# Altium project LPC1787-LCD-PCB.PrjPcb (part 2 of 3)

## Sheet SOC LPC1787.SchDoc
size 914 x 685 mm
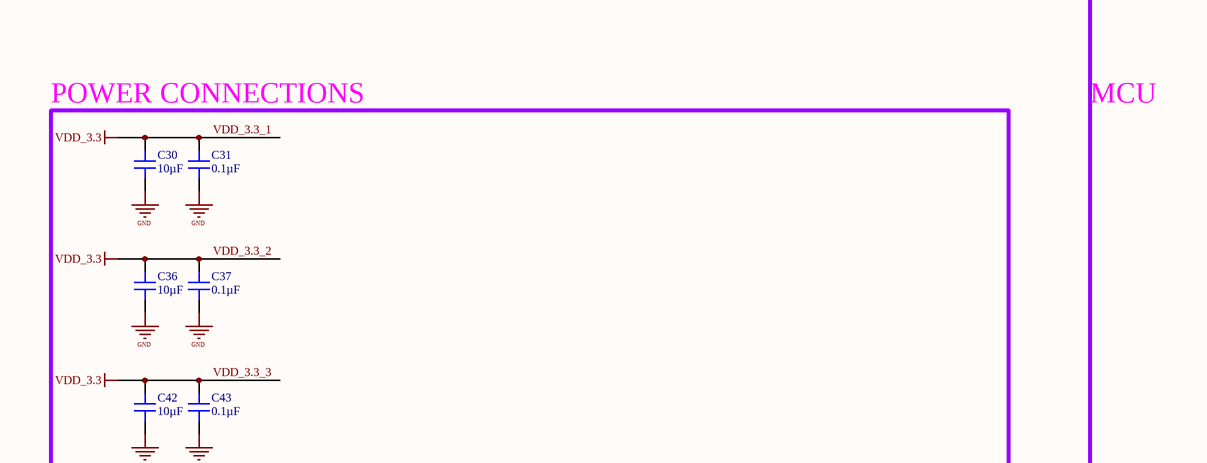
[diagram p3: SOC LPC1787.SchDoc, top left]
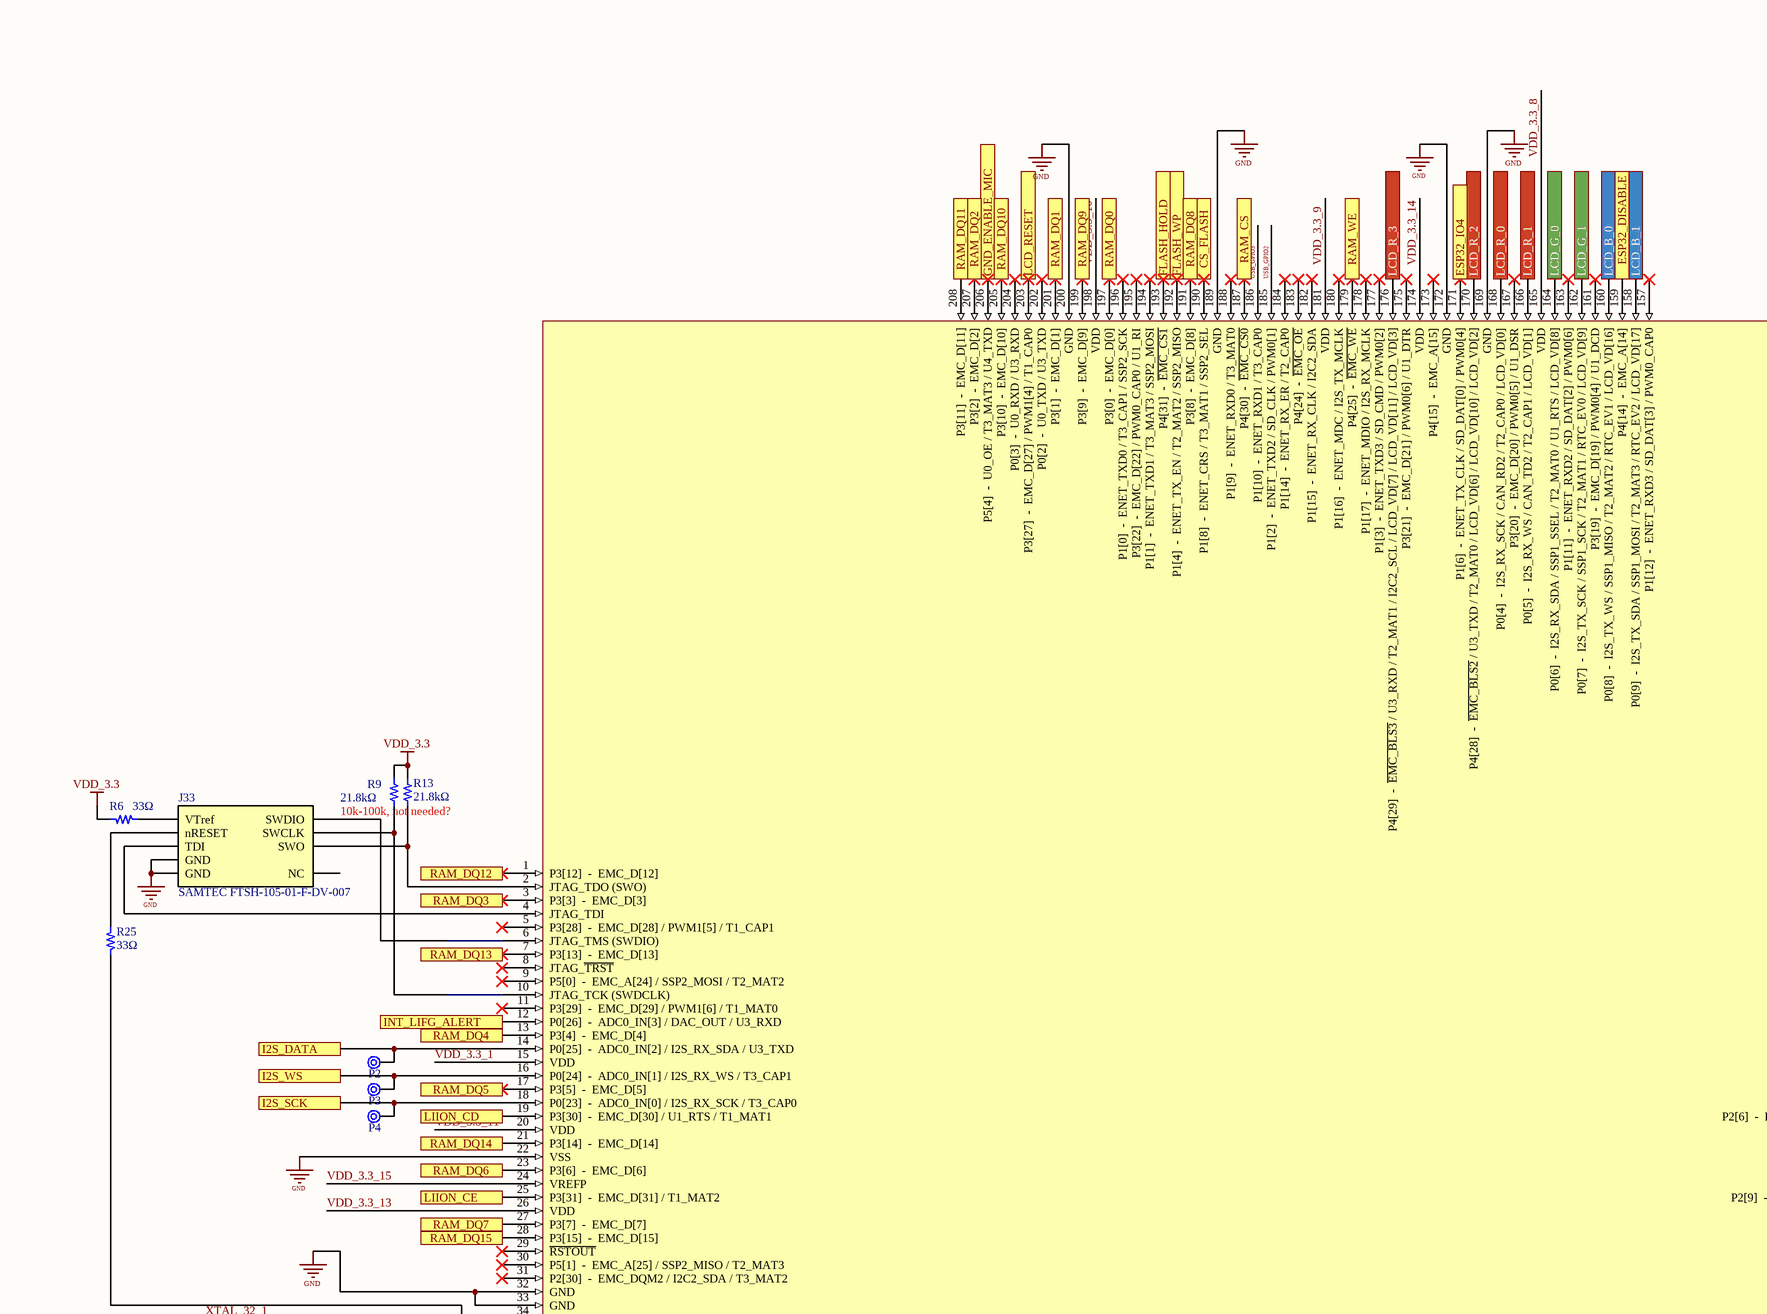
[diagram p4: SOC LPC1787.SchDoc, top middle]
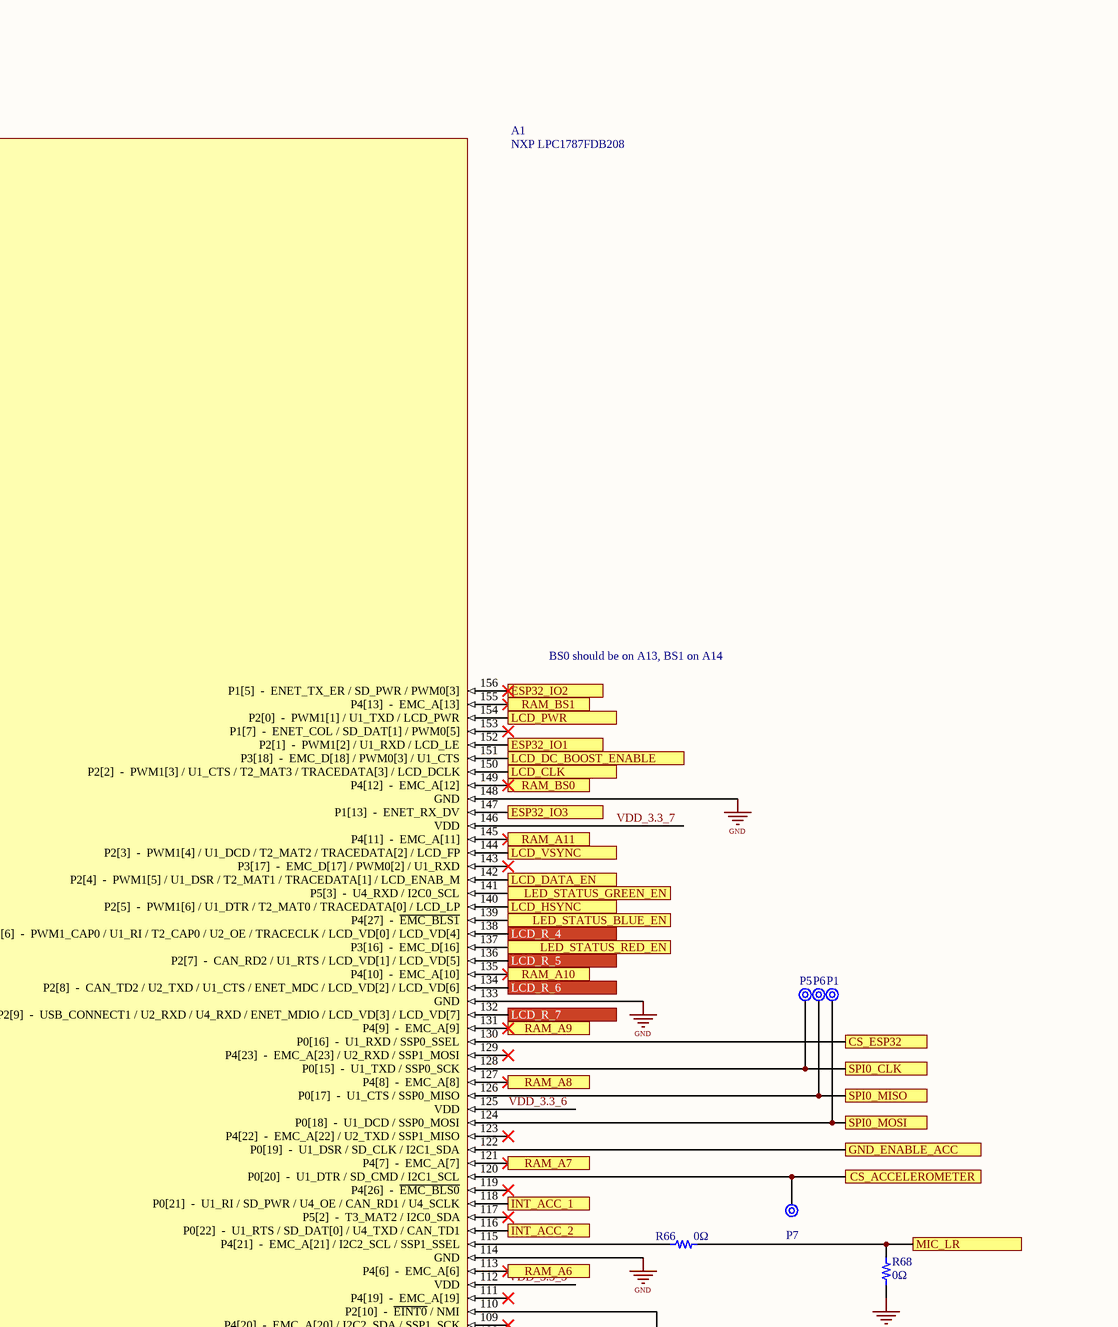
[diagram p5: SOC LPC1787.SchDoc, top right]
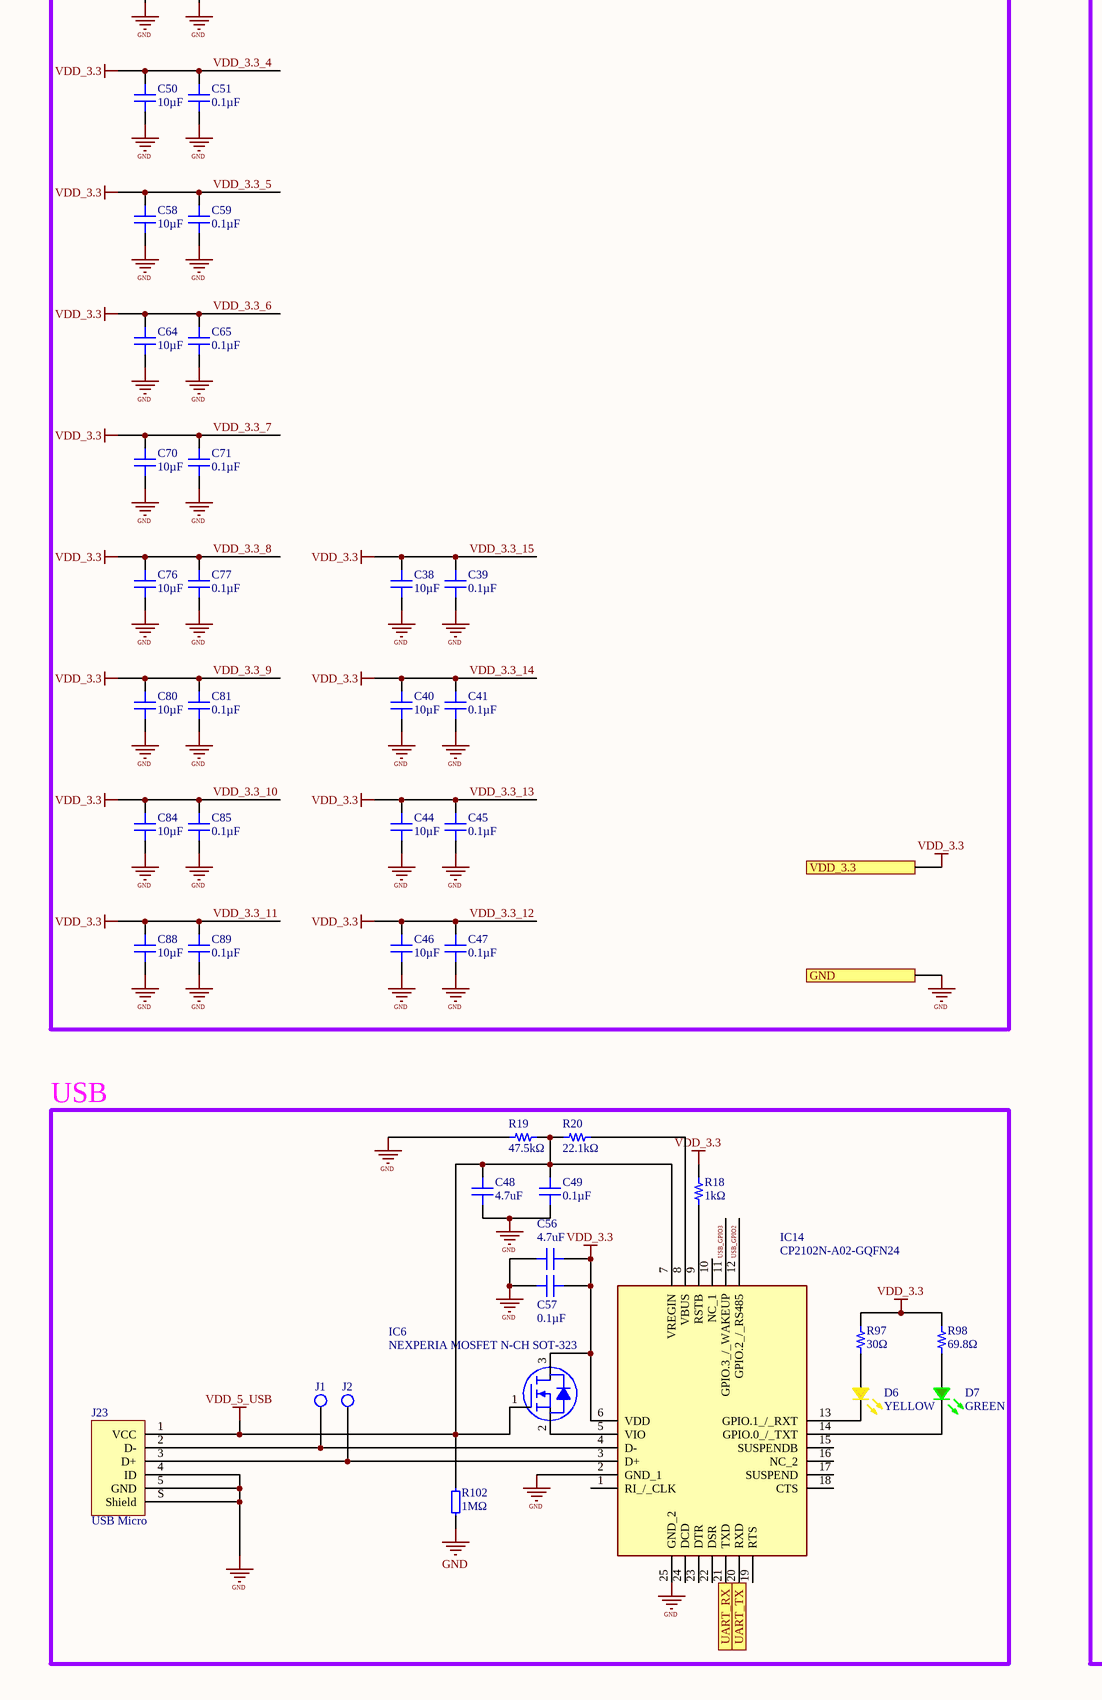
[diagram p6: SOC LPC1787.SchDoc, bottom left]
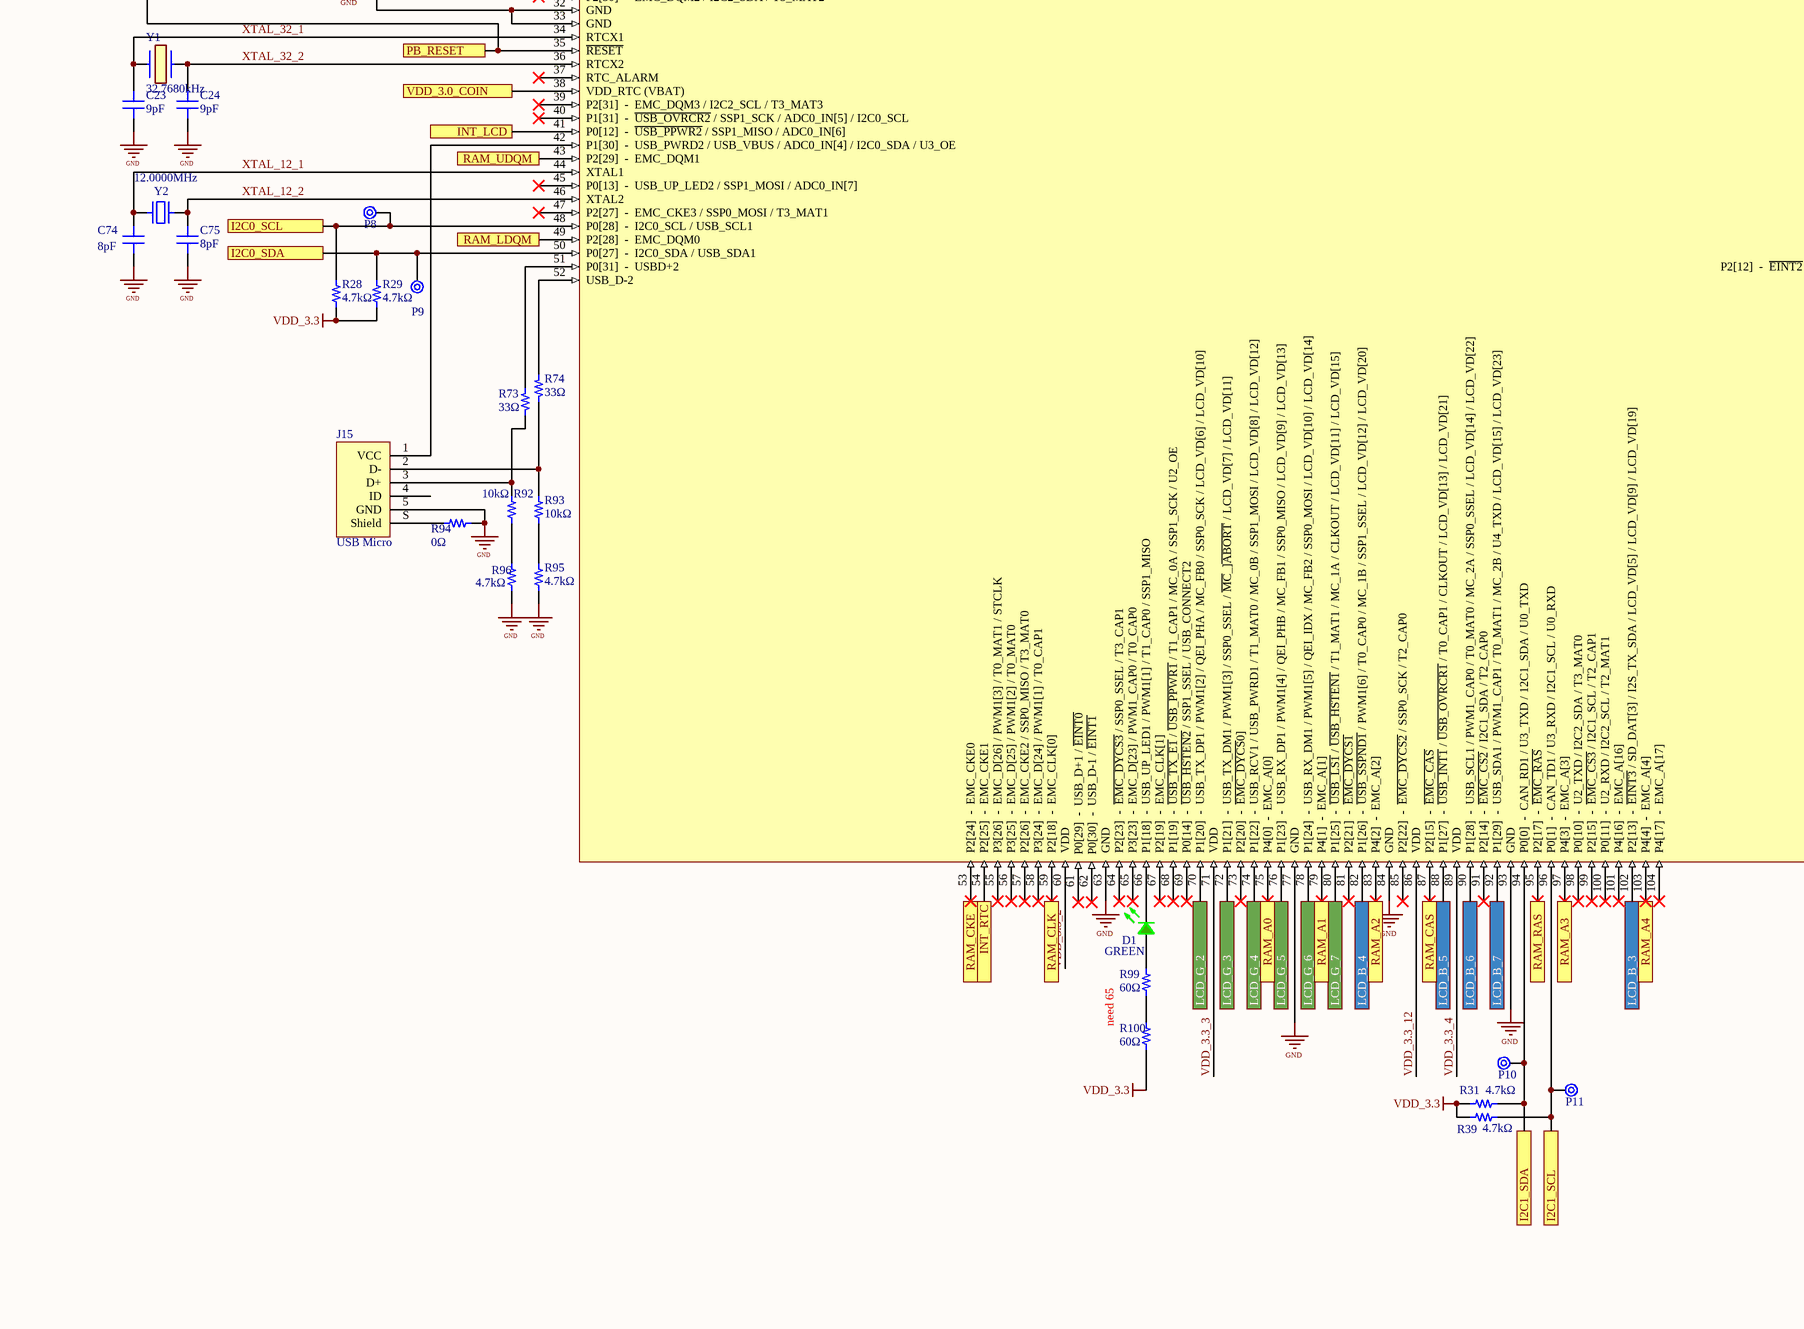
[diagram p7: SOC LPC1787.SchDoc, bottom middle]
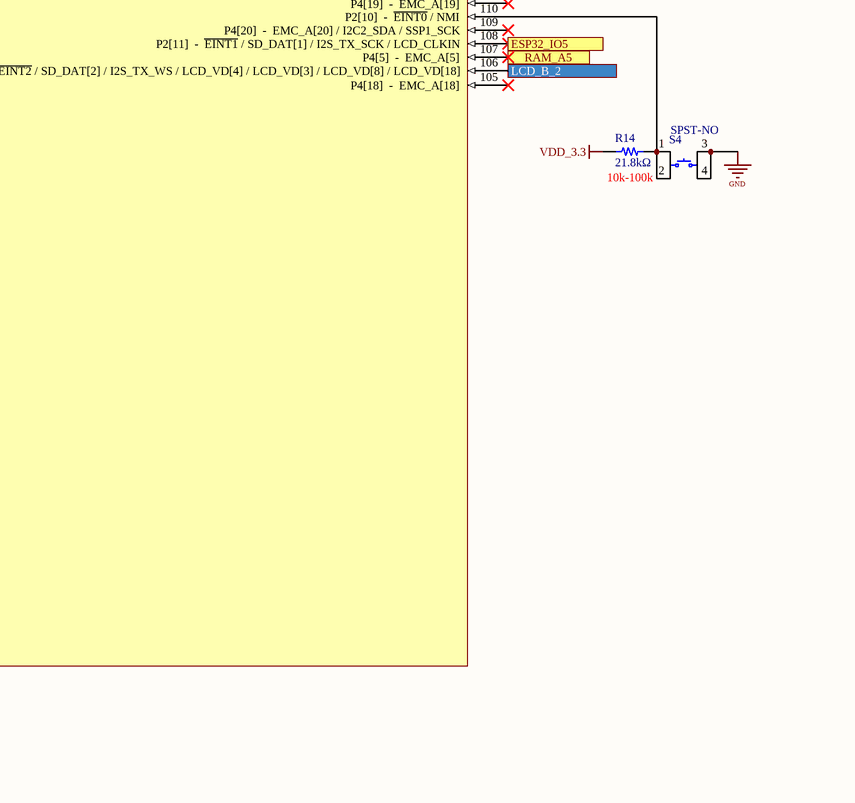
[diagram p8: SOC LPC1787.SchDoc, bottom right]

### Parts
A1  NXP LPC1787FDB208  [NXP LPC1787FDB208]
C23  9pF  [CAP 0402_1005]
C24  9pF  [CAP 0402_1005]
C30  10µF  [CAP 0603_1608]
C31  0.1µF  [CAP 0603_1608 RF]
C36  10µF  [CAP 0603_1608]
C37  0.1µF  [CAP 0603_1608 RF]
C38  10µF  [CAP 0603_1608]
C39  0.1µF  [CAP 0603_1608 RF]
C40  10µF  [CAP 0603_1608]
C41  0.1µF  [CAP 0603_1608 RF]
C42  10µF  [CAP 0603_1608]
C43  0.1µF  [CAP 0603_1608 RF]
C44  10µF  [CAP 0603_1608]
C45  0.1µF  [CAP 0603_1608 RF]
C46  10µF  [CAP 0603_1608]
C47  0.1µF  [CAP 0603_1608 RF]
C48  4.7uF  [CAP 0603_1608]
C49  0.1µF  [CAP 0603_1608 RF]
C50  10µF  [CAP 0603_1608]
C51  0.1µF  [CAP 0603_1608 RF]
C56  4.7uF  [CAP 0603_1608]
C57  0.1µF  [CAP 0603_1608 RF]
C58  10µF  [CAP 0603_1608]
C59  0.1µF  [CAP 0603_1608 RF]
C64  10µF  [CAP 0603_1608]
C65  0.1µF  [CAP 0603_1608 RF]
C70  10µF  [CAP 0603_1608]
C71  0.1µF  [CAP 0603_1608 RF]
C74  8pF  [CAP 0402_1005]
C75  8pF  [CAP 0402_1005]
C76  10µF  [CAP 0603_1608]
C77  0.1µF  [CAP 0603_1608 RF]
C80  10µF  [CAP 0603_1608]
C81  0.1µF  [CAP 0603_1608 RF]
C84  10µF  [CAP 0603_1608]
C85  0.1µF  [CAP 0603_1608 RF]
C88  10µF  [CAP 0603_1608]
C89  0.1µF  [CAP 0603_1608 RF]
D1  GREEN  [LED 0603_1608]
D6  YELLOW  [LED 0603_1608]
D7  GREEN  [LED 0603_1608]
IC6  NEXPERIA MOSFET N-CH SOT-323  [NEXPERIA SOT-323]
IC14  CP2102N-A02-GQFN24  [QFN50P400X400X80-25N-D]
J1  TEST POINT  [TEST POINT]  (value not drawn)
J2  TEST POINT  [TEST POINT]  (value not drawn)
J15  USB Micro  [MICRO USB B]
J23  USB Micro  [MICRO USB B]
J33  SAMTEC FTSH-105-01-F-DV-007  [SAMTEC_FTSH-105-01-F-DV-007]
P1  1 Pin  [1PINTHRU]  (value not drawn)
P2  1 Pin  [1PINTHRU]  (value not drawn)
P3  1 Pin  [1PINTHRU]  (value not drawn)
P4  1 Pin  [1PINTHRU]  (value not drawn)
P5  1 Pin  [1PINTHRU]  (value not drawn)
P6  1 Pin  [1PINTHRU]  (value not drawn)
P7  1 Pin  [1PINTHRU]  (value not drawn)
P8  1 Pin  [1PINTHRU]  (value not drawn)
P9  1 Pin  [1PINTHRU]  (value not drawn)
P10  1 Pin  [1PINTHRU]  (value not drawn)
P11  1 Pin  [1PINTHRU]  (value not drawn)
R6  33Ω  [RES 0201_0603]
R9  21.8kΩ  [RES 0603_1608 RF]
R13  21.8kΩ  [RES 0603_1608 RF]
R14  21.8kΩ  [RES 0603_1608 RF]
R18  1kΩ  [RES 0603_1608 RF]
R19  47.5kΩ  [RES 0603_1608 RF]
R20  22.1kΩ  [RES 0603_1608 RF]
R25  33Ω  [RES 0201_0603]
R28  4.7kΩ  [RES 0603_1608 RF]
R29  4.7kΩ  [RES 0603_1608 RF]
R31  4.7kΩ  [RES 0603_1608 RF]
R39  4.7kΩ  [RES 0603_1608 RF]
R66  0Ω  [RES 0603_1608 RF]
R68  0Ω  [RES 0603_1608 RF]
R73  33Ω  [RES 0201_0603]
R74  33Ω  [RES 0201_0603]
R92  10kΩ  [RES 0603_1608 RF]
R93  10kΩ  [RES 0603_1608 RF]
R94  0Ω  [RES 0603_1608 RF]
R95  4.7kΩ  [RES 0603_1608 RF]
R96  4.7kΩ  [RES 0603_1608 RF]
R97  30Ω  [RES 0603_1608 RF]
R98  69.8Ω  [RES 0603_1608 RF]
R99  60Ω  [RES 0603_1608 RF]
R100  60Ω  [RES 0603_1608 RF]
R102  1MΩ  [0603_1608 RF]  (no BOM)
S4  SPST-NO  [TE FSM4JSMA]
Y1  32.7680kHz  [EPSON FC135R]
Y2  12.0000MHz  [ECX 53B]

### Blocks framed on the sheet
MCU: A1 C23 C24 C74 C75 D1 J15 J33 P1-P11 R6 R9 R13 R14 R25 R28 R29 R31 R39 R66 R68 R73 R74 R92-R96 R99 R100 S4 Y1 Y2
POWER CONNECTIONS: C30 C31 C36-C47 C50 C51 C58 C59 C64 C65 C70 C71 C76 C77 C80 C81 C84 C85 C88 C89
USB: C48 C49 C56 C57 D6 D7 IC6 IC14 J1 J2 J23 R18-R20 R97 R98 R102

### Ports
CS_ACCELEROMETER, CS_ESP32, CS_FLASH, ESP32_DISABLE, ESP32_IO1, ESP32_IO2, ESP32_IO3, ESP32_IO4, ESP32_IO5, FLASH_HOLD, FLASH_WP, GND, GND_ENABLE_ACC, GND_ENABLE_MIC, I2C0_SCL, I2C0_SDA, I2C1_SCL, I2C1_SDA, I2S_DATA, I2S_SCK, I2S_WS, INT_ACC_1, INT_ACC_2, INT_LCD, INT_LIFG_ALERT, INT_RTC, LCD_B_0, LCD_B_1, LCD_B_2, LCD_B_3, LCD_B_4, LCD_B_5, LCD_B_6, LCD_B_7, LCD_CLK, LCD_DATA_EN, LCD_DC_BOOST_ENABLE, LCD_G_0, LCD_G_1, LCD_G_2, LCD_G_3, LCD_G_4, LCD_G_5, LCD_G_6, LCD_G_7, LCD_HSYNC, LCD_PWR, LCD_R_0, LCD_R_1, LCD_R_2, LCD_R_3, LCD_R_4, LCD_R_5, LCD_R_6, LCD_R_7, LCD_RESET, LCD_VSYNC, LED_STATUS_BLUE_EN, LED_STATUS_GREEN_EN, LED_STATUS_RED_EN, LIION_CD, LIION_CE, MIC_LR, PB_RESET, RAM_A0, RAM_A1, RAM_A2, RAM_A3, RAM_A4, RAM_A5, RAM_A6, RAM_A7, RAM_A8, RAM_A9, RAM_A10, RAM_A11, RAM_BS0, RAM_BS1, RAM_CAS, RAM_CKE, RAM_CLK, RAM_CS, RAM_DQ0, RAM_DQ1, RAM_DQ2, RAM_DQ3, RAM_DQ4, RAM_DQ5, RAM_DQ6, RAM_DQ7, RAM_DQ8, RAM_DQ9, RAM_DQ10, RAM_DQ11, RAM_DQ12, RAM_DQ13, RAM_DQ14, RAM_DQ15, RAM_LDQM, RAM_RAS, RAM_UDQM, RAM_WE, SPI0_CLK, SPI0_MISO, SPI0_MOSI, UART_RX, UART_TX, VDD_3.0_COIN, VDD_3.3

### Nets
GND: A1.22(VSS) A1.32(GND) A1.33(GND) A1.63(GND) A1.77(GND) A1.84(GND) A1.93(GND) A1.114(GND) A1.133(GND) A1.148(GND) A1.169(GND) A1.172(GND) A1.189(GND) A1.200(GND) C23.1 C24.1 C30.1 C31.1 C36.1 C37.1 C38.1 C39.1 C40.1 C41.1 C42.1 C43.1 C44.1 C45.1 C46.1 C47.1 C48.1 C49.1 C50.1 C51.1 C56.2 C57.1 C58.1 C59.1 C64.1 C65.1 C70.1 C71.1 C74.2 C75.2 C76.1 C77.1 C80.1 C81.1 C84.1 C85.1 C88.1 C89.1 IC14.2(GND_1) IC14.25(GND_2) J15.5(GND) J23.4(ID) J23.5(GND) J23.S(Shield) J33.03(GND) J33.05(GND) R19.2 R68.1 R94.2 R95.1 R96.1 R102.2 S4.3 S4.4 ; port GND
VDD_3.3_1: A1.15(VDD) A1.20(VDD) A1.24(VREFP) A1.26(VDD) A1.60(VDD) A1.71(VDD) A1.86(VDD) A1.89(VDD) A1.112(VDD) A1.125(VDD) A1.146(VDD) A1.165(VDD) A1.174(VDD) A1.181(VDD) A1.198(VDD) C30.2 C31.2 C36.2 C37.2 C38.2 C39.2 C40.2 C41.2 C42.2 C43.2 C44.2 C45.2 C46.2 C47.2 C50.2 C51.2 C56.1 C57.2 C58.2 C59.2 C64.2 C65.2 C70.2 C71.2 C76.2 C77.2 C80.2 C81.2 C84.2 C85.2 C88.2 C89.2 IC6.3(D) IC14.6(VDD) R6.2 R9.2 R13.2 R14.1 R18.2 R28.2 R29.2 R31.2 R39.2 R97.2 R98.2 R100.2 ; port VDD_3.3  [also labelled VDD_3.3, VDD_3.3_10, VDD_3.3_11, VDD_3.3_12, VDD_3.3_13, VDD_3.3_14, VDD_3.3_15, VDD_3.3_2, VDD_3.3_3, VDD_3.3_4, VDD_3.3_5, VDD_3.3_6, VDD_3.3_7, VDD_3.3_8, VDD_3.3_9]
VDD_5_USB: C48.2 C49.2 IC6.1(G) IC14.7(VREGIN) J23.1(VCC) R19.1 R20.1 R102.1
USB_GPIO2: A1.185(P1[2]__-__ENET_TXD2_/_SD_CLK_/_PWM0[1]) IC14.12(GPIO.2_/_RS485)
USB_GPIO3: A1.186(P1[10]__-__ENET_RXD1_/_T3_CAP0) IC14.11(GPIO.3_/_WAKEUP)
XTAL_12_1: A1.44(XTAL1) C74.1 Y2.2
XTAL_12_2: A1.46(XTAL2) C75.1 Y2.1
XTAL_32_1: A1.34(RTCX1) C23.2 Y1.1(CRYSTAL_1)
XTAL_32_2: A1.36(RTCX2) C24.2 Y1.2(CRYSTAL_2)
NetA1_1: A1.1(P3[12]__-__EMC_D[12]) ; port RAM_DQ12
NetA1_2: A1.2(JTAG_TDO_(SWO)) J33.06(SWO) R13.1
NetA1_3: A1.3(P3[3]__-__EMC_D[3]) ; port RAM_DQ3
NetA1_4: A1.4(JTAG_TDI) J33.08(TDI)
NetA1_6: A1.6(JTAG_TMS_(SWDIO)) J33.02(SWDIO)
NetA1_7: A1.7(P3[13]__-__EMC_D[13]) ; port RAM_DQ13
NetA1_10: A1.10(JTAG_TCK_(SWDCLK)) J33.04(SWCLK) R9.1
NetA1_12: A1.12(P0[26]__-__ADC0_IN[3]_/_DAC_OUT_/_U3_RXD) ; port INT_LIFG_ALERT
NetA1_13: A1.13(P3[4]__-__EMC_D[4]) ; port RAM_DQ4
NetA1_14: A1.14(P0[25]__-__ADC0_IN[2]_/_I2S_RX_SDA_/_U3_TXD) P2.1(PAD) ; port I2S_DATA
NetA1_16: A1.16(P0[24]__-__ADC0_IN[1]_/_I2S_RX_WS_/_T3_CAP1) P3.1(PAD) ; port I2S_WS
NetA1_17: A1.17(P3[5]__-__EMC_D[5]) ; port RAM_DQ5
NetA1_18: A1.18(P0[23]__-__ADC0_IN[0]_/_I2S_RX_SCK_/_T3_CAP0) P4.1(PAD) ; port I2S_SCK
NetA1_19: A1.19(P3[30]__-__EMC_D[30]_/_U1_RTS_/_T1_MAT1) ; port LIION_CD
NetA1_21: A1.21(P3[14]__-__EMC_D[14]) ; port RAM_DQ14
NetA1_23: A1.23(P3[6]__-__EMC_D[6]) ; port RAM_DQ6
NetA1_25: A1.25(P3[31]__-__EMC_D[31]_/_T1_MAT2) ; port LIION_CE
NetA1_27: A1.27(P3[7]__-__EMC_D[7]) ; port RAM_DQ7
NetA1_28: A1.28(P3[15]__-__EMC_D[15]) ; port RAM_DQ15
NetA1_35: A1.35(~{RESET}) R25.2 ; port PB_RESET
NetA1_38: A1.38(VDD_RTC_(VBAT)) ; port VDD_3.0_COIN
NetA1_41: A1.41(P0[12]__-__~{USB_PPWR2}_/_SSP1_MISO_/_ADC0_IN[6]) ; port INT_LCD
NetA1_42: A1.42(P1[30]__-__USB_PWRD2_/_USB_VBUS_/_ADC0_IN[4]_/_I2C0_SDA_/_U3_OE) J15.1(VCC)
NetA1_43: A1.43(P2[29]__-__EMC_DQM1) ; port RAM_UDQM
NetA1_48: A1.48(P0[28]__-__I2C0_SCL_/_USB_SCL1) P8.1(PAD) R28.1 ; port I2C0_SCL
NetA1_49: A1.49(P2[28]__-__EMC_DQM0) ; port RAM_LDQM
NetA1_50: A1.50(P0[27]__-__I2C0_SDA_/_USB_SDA1) P9.1(PAD) R29.1 ; port I2C0_SDA
NetA1_51: A1.51(P0[31]__-__USBD+2) R73.1
NetA1_52: A1.52(USB_D-2) R74.1
NetA1_53: A1.53(P2[24]__-__EMC_CKE0) ; port RAM_CKE
NetA1_54: A1.54(P2[25]__-__EMC_CKE1) ; port INT_RTC
NetA1_59: A1.59(P2[18]__-__EMC_CLK[0]) ; port RAM_CLK
NetA1_66: A1.66(P1[18]__-__USB_UP_LED1_/_PWM1[1]_/_T1_CAP0_/_SSP1_MISO) D1.2
NetA1_70: A1.70(P1[20]__-__USB_TX_DP1_/_PWM1[2]_/_QEI_PHA_/_MC_FB0_/_SSP0_SCK_/_LCD_VD[6]_/_LCD_VD[10]) ; port LCD_G_2
NetA1_72: A1.72(P1[21]__-__USB_TX_DM1_/_PWM1[3]_/_SSP0_SSEL_/_~{MC}_]~{ABORT}_/_LCD_VD[7]_/_LCD_VD[11]) ; port LCD_G_3
NetA1_74: A1.74(P1[22]__-__USB_RCV1_/_USB_PWRD1_/_T1_MAT0_/_MC_0B_/_SSP1_MOSI_/_LCD_VD[8]_/_LCD_VD[12]) ; port LCD_G_4
NetA1_75: A1.75(P4[0]__-__EMC_A[0]) ; port RAM_A0
NetA1_76: A1.76(P1[23]__-__USB_RX_DP1_/_PWM1[4]_/_QEI_PHB_/_MC_FB1_/_SSP0_MISO_/_LCD_VD[9]_/_LCD_VD[13]) ; port LCD_G_5
NetA1_78: A1.78(P1[24]__-__USB_RX_DM1_/_PWM1[5]_/_QEI_IDX_/_MC_FB2_/_SSP0_MOSI_/_LCD_VD[10]_/_LCD_VD[14]) ; port LCD_G_6
NetA1_79: A1.79(P4[1]__-__EMC_A[1]) ; port RAM_A1
NetA1_80: A1.80(P1[25]__-__~{USB_LS1}_/_~{USB_HSTEN1}_/_T1_MAT1_/_MC_1A_/_CLKOUT_/_LCD_VD[11]_/_LCD_VD[15]) ; port LCD_G_7
NetA1_82: A1.82(P1[26]__-__~{USB_SSPND1}_/_PWM1[6]_/_T0_CAP0_/_MC_1B_/_SSP1_SSEL_/_LCD_VD[12]_/_LCD_VD[20]) ; port LCD_B_4
NetA1_83: A1.83(P4[2]__-__EMC_A[2]) ; port RAM_A2
NetA1_87: A1.87(P2[15]__-__~{EMC_CAS}) ; port RAM_CAS
NetA1_88: A1.88(P1[27]__-__~{USB_INT1}_/_~{USB_OVRCR1}_/_T0_CAP1_/_CLKOUT_/_LCD_VD[13]_/_LCD_VD[21]) ; port LCD_B_5
NetA1_90: A1.90(P1[28]__-__USB_SCL1_/_PWM1_CAP0_/_T0_MAT0_/_MC_2A_/_SSP0_SSEL_/_LCD_VD[14]_/_LCD_VD[22]) ; port LCD_B_6
NetA1_92: A1.92(P1[29]__-__USB_SDA1_/_PWM1_CAP1_/_T0_MAT1_/_MC_2B_/_U4_TXD_/_LCD_VD[15]_/_LCD_VD[23]) ; port LCD_B_7
NetA1_94: A1.94(P0[0]__-__CAN_RD1_/_U3_TXD_/_12C1_SDA_/_U0_TXD) P10.1(PAD) R31.1 ; port I2C1_SDA
NetA1_95: A1.95(P2[17]__-__~{EMC_RAS}) ; port RAM_RAS
NetA1_96: A1.96(P0[1]__-__CAN_TD1_/_U3_RXD_/_I2C1_SCL_/_U0_RXD) P11.1(PAD) R39.1 ; port I2C1_SCL
NetA1_97: A1.97(P4[3]__-__EMC_A[3]) ; port RAM_A3
NetA1_102: A1.102(P2[13]__-__~{EINT3}_/_SD_DAT[3]_/_I2S_TX_SDA_/_LCD_VD[5]_/_LCD_VD[9]_/_LCD_VD[19]) ; port LCD_B_3
NetA1_103: A1.103(P4[4]__-__EMC_A[4]) ; port RAM_A4
NetA1_106: A1.106(P2[12]__-__~{EINT2}_/_SD_DAT[2]_/_I2S_TX_WS_/_LCD_VD[4]_/_LCD_VD[3]_/_LCD_VD[8]_/_LCD_VD[18]) ; port LCD_B_2
NetA1_107: A1.107(P4[5]__-__EMC_A[5]) ; port RAM_A5
NetA1_108: A1.108(P2[11]__-__~{EINT1}_/_SD_DAT[1]_/_I2S_TX_SCK_/_LCD_CLKIN) ; port ESP32_IO5
NetA1_110: A1.110(P2[10]__-__~{EINT0}_/_NMI) R14.2 S4.1 S4.2
NetA1_113: A1.113(P4[6]__-__EMC_A[6]) ; port RAM_A6
NetA1_115: A1.115(P4[21]__-__EMC_A[21]_/_I2C2_SCL_/_SSP1_SSEL) R66.1
NetA1_116: A1.116(P0[22]__-__U1_RTS_/_SD_DAT[0]_/_U4_TXD_/_CAN_TD1) ; port INT_ACC_2
NetA1_118: A1.118(P0[21]__-__U1_RI_/_SD_PWR_/_U4_OE_/_CAN_RD1_/_U4_SCLK) ; port INT_ACC_1
NetA1_120: A1.120(P0[20]__-__U1_DTR_/_SD_CMD_/_I2C1_SCL) P7.1(PAD) ; port CS_ACCELEROMETER
NetA1_121: A1.121(P4[7]__-__EMC_A[7]) ; port RAM_A7
NetA1_122: A1.122(P0[19]__-__U1_DSR_/_SD_CLK_/_I2C1_SDA) ; port GND_ENABLE_ACC
NetA1_124: A1.124(P0[18]__-__U1_DCD_/_SSP0_MOSI) P1.1(PAD) ; port SPI0_MOSI
NetA1_126: A1.126(P0[17]__-__U1_CTS_/_SSP0_MISO) P6.1(PAD) ; port SPI0_MISO
NetA1_127: A1.127(P4[8]__-__EMC_A[8]) ; port RAM_A8
NetA1_128: A1.128(P0[15]__-__U1_TXD_/_SSP0_SCK) P5.1(PAD) ; port SPI0_CLK
NetA1_130: A1.130(P0[16]__-__U1_RXD_/_SSP0_SSEL) ; port CS_ESP32
NetA1_131: A1.131(P4[9]__-__EMC_A[9]) ; port RAM_A9
NetA1_132: A1.132(P2[9]__-__USB_CONNECT1_/_U2_RXD_/_U4_RXD_/_ENET_MDIO_/_LCD_VD[3]_/_LCD_VD[7]) ; port LCD_R_7
NetA1_134: A1.134(P2[8]__-__CAN_TD2_/_U2_TXD_/_U1_CTS_/_ENET_MDC_/_LCD_VD[2]_/_LCD_VD[6]) ; port LCD_R_6
NetA1_135: A1.135(P4[10]__-__EMC_A[10]) ; port RAM_A10
NetA1_136: A1.136(P2[7]__-__CAN_RD2_/_U1_RTS_/_LCD_VD[1]_/_LCD_VD[5]) ; port LCD_R_5
NetA1_137: A1.137(P3[16]__-__EMC_D[16]) ; port LED_STATUS_RED_EN
NetA1_138: A1.138(P2[6]__-__PWM1_CAP0_/_U1_RI_/_T2_CAP0_/_U2_OE_/_TRACECLK_/_LCD_VD[0]_/_LCD_VD[4]) ; port LCD_R_4
NetA1_139: A1.139(P4[27]__-__~{EMC_BLS1}) ; port LED_STATUS_BLUE_EN
NetA1_140: A1.140(P2[5]__-__PWM1[6]_/_U1_DTR_/_T2_MAT0_/_TRACEDATA[0]_/_LCD_LP) ; port LCD_HSYNC
NetA1_141: A1.141(P5[3]__-__U4_RXD_/_I2C0_SCL) ; port LED_STATUS_GREEN_EN
NetA1_142: A1.142(P2[4]__-__PWM1[5]_/_U1_DSR_/_T2_MAT1_/_TRACEDATA[1]_/_LCD_ENAB_M) ; port LCD_DATA_EN
NetA1_144: A1.144(P2[3]__-__PWM1[4]_/_U1_DCD_/_T2_MAT2_/_TRACEDATA[2]_/_LCD_FP) ; port LCD_VSYNC
NetA1_145: A1.145(P4[11]__-__EMC_A[11]) ; port RAM_A11
NetA1_147: A1.147(P1[13]__-__ENET_RX_DV) ; port ESP32_IO3
NetA1_149: A1.149(P4[12]__-__EMC_A[12]) ; port RAM_BS0
NetA1_150: A1.150(P2[2]__-__PWM1[3]_/_U1_CTS_/_T2_MAT3_/_TRACEDATA[3]_/_LCD_DCLK) ; port LCD_CLK
NetA1_151: A1.151(P3[18]__-__EMC_D[18]_/_PWM0[3]_/_U1_CTS) ; port LCD_DC_BOOST_ENABLE
NetA1_152: A1.152(P2[1]__-__PWM1[2]_/_U1_RXD_/_LCD_LE) ; port ESP32_IO1
NetA1_154: A1.154(P2[0]__-__PWM1[1]_/_U1_TXD_/_LCD_PWR) ; port LCD_PWR
NetA1_155: A1.155(P4[13]__-__EMC_A[13]) ; port RAM_BS1
NetA1_156: A1.156(P1[5]__-__ENET_TX_ER_/_SD_PWR_/_PWM0[3]) ; port ESP32_IO2
NetA1_158: A1.158(P0[9]__-__I2S_TX_SDA_/_SSP1_MOSI_/_T2_MAT3_/_RTC_EV2_/_LCD_VD[17]) ; port LCD_B_1
NetA1_159: A1.159(P4[14]__-__EMC_A[14]) ; port ESP32_DISABLE
NetA1_160: A1.160(P0[8]__-__I2S_TX_WS_/_SSP1_MISO_/_T2_MAT2_/_RTC_EV1_/_LCD_VD[16]) ; port LCD_B_0
NetA1_162: A1.162(P0[7]__-__I2S_TX_SCK_/_SSP1_SCK_/_T2_MAT1_/_RTC_EV0_/_LCD_VD[9]) ; port LCD_G_1
NetA1_164: A1.164(P0[6]__-__I2S_RX_SDA_/_SSP1_SSEL_/_T2_MAT0_/_U1_RTS_/_LCD_VD[8]) ; port LCD_G_0
NetA1_166: A1.166(P0[5]__-__I2S_RX_WS_/_CAN_TD2_/_T2_CAP1_/_LCD_VD[1]) ; port LCD_R_1
NetA1_168: A1.168(P0[4]__-__I2S_RX_SCK_/_CAN_RD2_/_T2_CAP0_/_LCD_VD[0]) ; port LCD_R_0
NetA1_170: A1.170(P4[28]__-__~{EMC_BLS2}_/_U3_TXD_/_T2_MAT0_/_LCD_VD[6]_/_LCD_VD[10]_/_LCD_VD[2]) ; port LCD_R_2
NetA1_171: A1.171(P1[6]__-__ENET_TX_CLK_/_SD_DAT[0]_/_PWM0[4]) ; port ESP32_IO4
NetA1_176: A1.176(P4[29]__-__~{EMC_BLS3}_/_U3_RXD_/_T2_MAT1_/_I2C2_SCL_/_LCD_VD[7]_/_LCD_VD[11]_/_LCD_VD[3]) ; port LCD_R_3
NetA1_179: A1.179(P4[25]__-__~{EMC_WE}) ; port RAM_WE
NetA1_187: A1.187(P4[30]__-__~{EMC_CS0}) ; port RAM_CS
NetA1_190: A1.190(P1[8]__-__ENET_CRS_/_T3_MAT1_/_SSP2_SEL) ; port CS_FLASH
NetA1_191: A1.191(P3[8]__-__EMC_D[8]) ; port RAM_DQ8
NetA1_192: A1.192(P1[4]__-__ENET_TX_EN_/_T2_MAT2_/_SSP2_MISO) ; port FLASH_WP
NetA1_193: A1.193(P4[31]__-__~{EMC_CS1}) ; port FLASH_HOLD
NetA1_197: A1.197(P3[0]__-__EMC_D[0]) ; port RAM_DQ0
NetA1_199: A1.199(P3[9]__-__EMC_D[9]) ; port RAM_DQ9
NetA1_201: A1.201(P3[1]__-__EMC_D[1]) ; port RAM_DQ1
NetA1_203: A1.203(P3[27]__-__EMC_D[27]_/_PWM1[4]_/_T1_CAP0) ; port LCD_RESET
NetA1_205: A1.205(P3[10]__-__EMC_D[10]) ; port RAM_DQ10
NetA1_206: A1.206(P5[4]__-__U0_OE_/_T3_MAT3_/_U4_TXD) ; port GND_ENABLE_MIC
NetA1_207: A1.207(P3[2]__-__EMC_D[2]) ; port RAM_DQ2
NetA1_208: A1.208(P3[11]__-__EMC_D[11]) ; port RAM_DQ11
NetD1_1: D1.1 R99.2
NetD6_1: D6.1 R97.1
NetD6_2: D6.2 IC14.13(GPIO.1_/_RXT)
NetD7_1: D7.1 R98.1
NetD7_2: D7.2 IC14.14(GPIO.0_/_TXT)
NetIC6_2: IC6.2(S) IC14.5(VIO)
NetIC14_3: IC14.3(D+) J2.1(PAD) J23.3(D+)
NetIC14_4: IC14.4(D-) J1.1(PAD) J23.2(D-)
NetIC14_8: IC14.8(VBUS) R20.2
NetIC14_9: IC14.9(RSTB) R18.1
NetIC14_20: IC14.20(RXD) ; port UART_TX
NetIC14_21: IC14.21(TXD) ; port UART_RX
NetJ15_2: J15.2(D-) R74.2 R93.2
NetJ15_3: J15.3(D+) R73.2 R92.2
NetJ15_S: J15.S(Shield) R94.1
NetJ33_01: J33.01(VTref) R6.1
NetJ33_10: J33.10(nRESET) R25.1
NetMK1_1: R66.2 R68.2 ; port MIC_LR
NetR92_1: R92.1 R96.2
NetR93_1: R93.1 R95.2
NetR99_1: R99.1 R100.1

Not connected (* = marked no-connect by the designer): A1 5(P3[28]__-__EMC_D[28]_/_PWM1[5]_/_T1_CAP1)* 8(JTAG_~{TRST})* 9(P5[0]__-__EMC_A[24]_/_SSP2_MOSI_/_T2_MAT2)* 11(P3[29]__-__EMC_D[29]_/_PWM1[6]_/_T1_MAT0)* 29(~{RSTOUT})* 30(P5[1]__-__EMC_A[25]_/_SSP2_MISO_/_T2_MAT3)* 31(P2[30]__-__EMC_DQM2_/_I2C2_SDA_/_T3_MAT2)* 37(RTC_ALARM)* 39(P2[31]__-__EMC_DQM3_/_I2C2_SCL_/_T3_MAT3)* 40(P1[31]__-__~{USB_OVRCR2}_/_SSP1_SCK_/_ADC0_IN[5]_/_I2C0_SCL)* 45(P0[13]__-__USB_UP_LED2_/_SSP1_MOSI_/_ADC0_IN[7])* 47(P2[27]__-__EMC_CKE3_/_SSP0_MOSI_/_T3_MAT1)* 55(P3[26]__-__EMC_D[26]_/_PWM1[3]_/_T0_MAT1_/_STCLK)* 56(P3[25]__-__EMC_D[25]_/_PWM1[2]_/_T0_MAT0)* 57(P2[26]__-__EMC_CKE2_/_SSP0_MISO_/_T3_MAT0)* 58(P3[24]__-__EMC_D[24]_/_PWM1[1]_/_T0_CAP1)* 61(P0[29]__-__USB_D+1_/_~{EINT0})* 62(P0[30]__-__USB_D-1_/_~{EINT1})* 64(P2[23]__-__~{EMC_DYCS3}_/_SSP0_SSEL_/_T3_CAP1)* 65(P3[23]__-__EMC_D[23]_/_PWM1_CAP0_/_T0_CAP0)* 67(P2[19]__-__EMC_CLK[1])* 68(P1[19]__-__~{USB_TX_E1}_/_~{USB_PPWR1}_/_T1_CAP1_/_MC_0A_/_SSP1_SCK_/_U2_OE)* 69(P0[14]__-__~{USB_HSTEN2}_/_SSP1_SSEL_/_USB_CONNECT2)* 73(P2[20]__-__~{EMC_DYCS}0])* 81(P2[21]__-__~{EMC_DYCS1})* 85(P2[22]__-__~{EMC_DYCS2}_/_SSP0_SCK_/_T2_CAP0)* 91(P2[14]__-__~{EMC_CS2}_/_I2C1_SDA_/_T2_CAP0)* 98(P0[10]__-__U2_TXD_/_I2C2_SDA_/_T3_MAT0)* 99(P2[15]__-__~{EMC_CS3}_/_I2C1_SCL_/_T2_CAP1)* 100(P0[11]__-__U2_RXD_/_I2C2_SCL_/_T2_MAT1)* 101(P4[16]__-__EMC_A[16])* 104(P4[17]__-__EMC_A[17])* 105(P4[18]__-__EMC_A[18])* 109(P4[20]__-__EMC_A[20]_/_I2C2_SDA_/_SSP1_SCK)* 111(P4[19]__-__EMC_A[19])* 117(P5[2]__-__T3_MAT2_/_I2C0_SDA)* 119(P4[26]__-__~{EMC_BLS0})* 123(P4[22]__-__EMC_A[22]_/_U2_TXD_/_SSP1_MISO)* 129(P4[23]__-__EMC_A[23]_/_U2_RXD_/_SSP1_MOSI)* 143(P3[17]__-__EMC_D[17]_/_PWM0[2]_/_U1_RXD)* 153(P1[7]__-__ENET_COL_/_SD_DAT[1]_/_PWM0[5])* 157(P1[12]__-__ENET_RXD3_/_SD_DAT[3]_/_PWM0_CAP0)* 161(P3[19]__-__EMC_D[19]_/_PWM0[4]_/_U1_DCD)* 163(P1[11]__-__ENET_RXD2_/_SD_DAT[2]_/_PWM0[6])* 167(P3[20]__-__EMC_D[20]_/_PWM0[5]_/_U1_DSR)* 173(P4[15]__-__EMC_A[15])* 175(P3[21]__-__EMC_D[21]_/_PWM0[6]_/_U1_DTR)* 177(P1[3]__-__ENET_TXD3_/_SD_CMD_/_PWM0[2])* 178(P1[17]__-__ENET_MDIO_/_I2S_RX_MCLK)* 180(P1[16]__-__ENET_MDC_/_I2S_TX_MCLK)* 182(P1[15]__-__ENET_RX_CLK_/_I2C2_SDA)* 183(P4[24]__-__~{EMC_OE})* 184(P1[14]__-__ENET_RX_ER_/_T2_CAP0)* 188(P1[9]__-__ENET_RXD0_/_T3_MAT0)* 194(P1[1]__-__ENET_TXD1_/_T3_MAT3_/_SSP2_MOSI)* 195(P3[22]__-__EMC_D[22]_/_PWM0_CAP0_/_U1_RI)* 196(P1[0]__-__ENET_TXD0_/_T3_CAP1_/_SSP2_SCK)* 202(P0[2]__-__U0_TXD_/_U3_TXD)* 204(P0[3]__-__U0_RXD_/_U3_RXD)*; IC14 1(RI_/_CLK) 10(NC_1) 15(SUSPENDB) 16(NC_2) 17(SUSPEND) 18(CTS) 19(RTS) 22(DSR) 23(DTR) 24(DCD); J15 4(ID); J33 09(NC)

### Notes on the sheet
- 10k-100k, not needed?
- BS0 should be on A13, BS1 on A14
- 10k-100k
- need 65

### Library data of the parts
A1 = SOC00006: VALUE: SoC; Voltage Supply: 2.4V ~ 3.6V; GPIO: 145; Device ID: SOC00006; Part Type: IC; Manufacturer: NXP; Manufacturer P/N: LPC1787FDB208; Package: MODULE; Supplier1: Digi-Key; Supplier1 P/N: 568-7575-ND‎; Supplier2: Mouser; Supplier2 P/N: 771-LPC1787FBD208551; Mounting Type: Surface Mount
C23 C24 = CAP0004E: CAP CER 9PF 50V NPO 0402; Manufacturer: Walsin; Manufacturer P/N: 0402N9R0B500CT; Tolerance: ±0.1%; Temperature Coefficient: C0G, NP0; Device ID: CAP0004E; Mounting Type: Surface Mount; Part Type: Capacitor; VALUE: 9pF; Operating Temperature: -55°C ~ 125°C; Voltage: 50V; Package: 0402 (1005 Metric); Supplier1: Digi-Key; Supplier1 P/N: 1292-0402N9R0B500CTTR-ND; Supplier2: Mouser; Supplier2 P/N: 791-0402N9R0B500CT
C30 C36 C38 C40 C42 C44 C46 C50 C58 C64 C70 C76 C80 C84 C88 = CAP00040: CAP CER 010UF 25V X7R 0603; Manufacturer: KEMET; Manufacturer P/N: C0603C273K3RACTU; Tolerance: ±10%; Device ID: CAP00040; Mounting Type: Surface Mount; Part Type: Capacitor; VALUE: 10µF; Operating Temperature: -55°C ~ 125°C; Voltage: 25V; Package: 0603 (1608 Metric); Supplier1: Digi-Key; Supplier1 P/N: 399-7891-1-ND; Supplier2: Mouser; Supplier2 P/N: 80-C0603C273K3R; Temperature Coefficient: X7R
C31 C37 C39 C41 C43 C45 C47 C49 C51 C57 C59 C65 C71 C77 C81 C85 C89 = CAP00039: CAP CER 0.1UF 16V X7R 0603; Manufacturer: KEMET; Manufacturer P/N: C0603C104M4RACAUTO; Tolerance: ±20%; Device ID: CAP00039; Mounting Type: Surface Mount; Part Type: Capacitor; VALUE: 0.1µF; Operating Temperature: -55°C ~ 125°C; Voltage: 16V; Package: 0603 (1608 Metric); Supplier1: Digi-Key; Supplier1 P/N: 399-C0603C104M4RACAUTOCT-ND; Supplier2: Mouser; Supplier2 P/N: C0603C104M4RACAUTO; Temperature Coefficient: X7R
C48 C56 = CAP00044: CAP CER 4.7UF 50V X7R 0603; Manufacturer: KEMET; Manufacturer P/N: CL10A475KQ8NNNC; Voltage: 25V; Tolerance: ±10%; Device ID: CAP00044; Mounting Type: Surface Mount; Part Type: Capacitor; VALUE: 4.7uF; Operating Temperature: -55°C ~ 125°C; Package: 0603 (1608 Metric); Supplier1: Digi-Key; Supplier1 P/N: 399-7891-1-ND; Supplier2: Mouser; Supplier2 P/N: 80-C0603C273K3R; Temperature Coefficient: X7R
C74 C75 = CAP00042: CAP CER 12.5PF 16V C0G/NP0 0402; Manufacturer: KEMET; Manufacturer P/N: C0402C101K4GACTU; Voltage: 10V; Tolerance: ±1%; Temperature Coefficient: C0G, NP0; Device ID: CAP00042; Mounting Type: Surface Mount; Part Type: Capacitor; VALUE: 8pF; Operating Temperature: -55°C ~ 125°C; Package: 0402 (1005 Metric); Supplier1: Digi-Key; Supplier1 P/N: 399-7749-1-ND; Supplier2: Mouser; Supplier2 P/N: 80-C0402C101K4G
D1 D7 = LED0000B: LED RED CLEAR 0603 SMD; Manufacturer: Würth Elektronik; Manufacturer P/N: 150060RS75000; If - Forward Current: 100mA; Vf - Forward Voltage: 2.0V; Wavelength: 625nm; Viewing Angle: 140°; Lens Color: Colorless; Device ID: LED0000B; VALUE: GREEN; Mounting Type: Surface Mount; Part Type: LED; Operating Temperature: -40°C ~ 85°C; Package: 0603 (1608 Metric); Color: Red; Supplier1: Digi-Key; Supplier1 P/N: 732-4978-1-ND
D6 = LED0000D: LED RED CLEAR 0603 SMD; Manufacturer: Würth Elektronik; Manufacturer P/N: 150060RS75000; If - Forward Current: 100mA; Vf - Forward Voltage: 2.0V; Wavelength: 625nm; Viewing Angle: 140°; Lens Color: Colorless; Device ID: LED0000D; VALUE: YELLOW; Mounting Type: Surface Mount; Part Type: LED; Operating Temperature: -40°C ~ 85°C; Package: 0603 (1608 Metric); Color: Red; Supplier1: Digi-Key; Supplier1 P/N: 732-4978-1-ND
IC6 = MOS00000: MOSFET N-CH 60V 320MA SOT323; Manufacturer: Nexperia USA Inc.; Manufacturer P/N: BSS138PW,115; FET Type: N-Channel; VALUE: NFET; Current - Continuous Drain (Id) @ 25°C: 320mA (Ta); Drive Voltage (Max Rds On, Min Rds On): 10V; Rds On (Max) @ Id, Vgs: 1.6Ohm @ 300mA, 10V; Vgs(th) (Max) @ Id: 1.5V @ 250µA; Vgs (Max): ±20V; Power Dissipation (Max): 260mW (Ta), 830mW (Tc); Gate Charge (Qg) (Max) @ Vgs: 0.8 nC @ 4.5 V; Input Capacitance (Ciss) (Max) @ Vds: 50 pF @ 10 V; Device ID: MOS00000; Package: SOT-323; Part Type: IC; Technology: MOSFET (Metal Oxide); FET Feature: -; Operating Temperature: -55°C ~ 150°C (TA); Mounting Type: Surface Mount; Drain to Source Voltage (Vdss): 60V; Supplier1: Digi-Key; Supplier1 P/N: 1727-1143-1-ND; Supplier2: Mouser; Supplier2 P/N: 771-BSS138PW115
IC14 = CP2102N-A02-GQFN24: Integrated Circuit; Manufacturer_Name: Silicon Labs; Datasheet Link: https://componentsearchengine.com//CP2102N-A02-GQFN24.pdf; Height: 0.8mm; Mouser2 Part Number: 634-CP2102NA02GQFN24; Mouser2 Price/Stock: https://www.mouser.com/Search/Refine.aspx?Keyword=634-CP2102NA02GQFN24; Manufacturer_Part_Number: CP2102N-A02-GQFN24
J1 J2 = -: Device ID: CON00015; Connector Type: Pad; Number of Positions: 1; Number of Positions Loaded: All; VALUE: Test Point; Mounting Type: Surface Mount; Part Type: Header; Manufacturer: -; Manufacturer P/N: -; Operating Temperature: -; Package: -; Contact Type: Pad; Style: Pad; Pitch - Mating: -; Fastening Type: -; Contact Finish - Mating: Gold; Insulation Color: -; Material Flammability Rating: -; Current Rating (Amps): -; Voltage Rating: -; Supplier1: -; Supplier1 P/N: -; Supplier2: -; Supplier2 P/N: -
J15 J23 = USB MICRO B: Manufacturer: TE; Manufacturer P/N: 123; Device ID: CON00014; VALUE: 5-Pin Board-to-Cable; Connector Type: Center Strip Contacts; Style: Board to Board; Number of Positions: 9; Number of Positions Loaded: All; Pitch - Mating: 0.012" (0.30mm); Mounting Type: Surface Mount; Part Type: Header; Operating Temperature: -40°C ~ 105°C; Package: N/A; Contact Type: Pins; Fastening Type: -; Contact Finish - Mating: Tin; Insulation Color: -; Material Flammability Rating: -; Current Rating (Amps): -; Voltage Rating: -; Supplier1: Digi-Key; Supplier1 P/N: 1253-046844745002846+CT-ND; Supplier2: Mouser; Supplier2 P/N: 346-046844745002846+
J33 = 9 PIN JLINK: Connector Header Surface Mount 10 position 0.050 (1.27mm); Manufacturer: TE; Manufacturer P/N: 123; Value: 9-Pin Board-to-Board; MP: FTSH-105-01-F-DV-007-K-P; Device ID: CON00013; Connector Type: Center Strip Contacts; Style: Board to Board; Number of Positions: 9; Number of Positions Loaded: All; Pitch - Mating: 0.012" (0.30mm); SnapEDA_Link: https://www.snapeda.com/parts/FTSH-105-01-F-DV-007-K-P/Samtec%20Inc./view-part/700165/?ref=snap; MF: Samtec; Digi-Key_Part_Number: SAM13926TR-ND; Check_prices: https://www.snapeda.com/parts/FTSH-105-01-F-DV-007-K-P/Samtec%20Inc./view-part/700165/?ref=eda; Package: N/A; Purchase-URL: https://pricing.snapeda.com/search/part/FTSH-105-01-F-DV-007-K-P/?ref=eda; Mounting Type: Surface Mount; Part Type: Header; Operating Temperature: -40°C ~ 105°C; Contact Type: Pins; Fastening Type: -; Contact Finish - Mating: Tin; Insulation Color: -; Material Flammability Rating: -; Current Rating (Amps): -; Voltage Rating: -; Supplier1: Digi-Key; Supplier1 P/N: 1253-046844745002846+CT-ND; Supplier2: Mouser; Supplier2 P/N: 346-046844745002846+
P1-P11 = 1 THRU HOLE: Device ID: CON00017; VALUE: 1 Pin Thru; Connector Type: Center Strip Contacts; Style: Board to Board; Number of Positions: 1; Number of Positions Loaded: All; Mounting Type: Surface Mount; Part Type: Header; Package: N/A; Contact Type: Pins; Pitch - Mating: -; Fastening Type: -; Contact Finish - Mating: Tin; Insulation Color: -; Material Flammability Rating: -; Current Rating (Amps): -; Voltage Rating: -; Supplier1: -; Supplier1 P/N: -; Supplier2: -; Supplier2 P/N: -
R6 R25 R73 R74 = RES0003A: RES SMD 33 OHM 1% 1/20W 0201; Manufacturer: Vishay Dale; Manufacturer P/N: CRCW020110R0FNED; Power: 0.050W; Device ID: RES0003A; VALUE: 33Ω; Mounting Type: Surface Mount; Part Type: Resistor; Operating Temperature: -55°C ~ 155°C; Package: 0201 (0603 Metric); Tolerance: ±1%; Composition: Thick Film; Supplier1: Digi-Key; Supplier1 P/N: 541-10.0ABCT-ND; Supplier2: Mouser; Supplier2 P/N: 71-CRCW020110R0FNED
R9 R13 R14 = RES00031: RES 21.8k OHM 1% 1/10W 0603; Manufacturer: Vishay Dale; Manufacturer P/N: ‎CRCW0603820KFKEAC‎; Power: 0.100W; Device ID: RES00031; VALUE: 21.8kΩ; Mounting Type: Surface Mount; Part Type: Resistor; Operating Temperature: -55°C ~ 155°C; Package: 0603 (1608 Metric); Tolerance: ±1%; Composition: Thick Film; Supplier1: Digi-Key; Supplier1 P/N: ‎541-5568-1-ND‎; Supplier2: Mouser; Supplier2 P/N: 71-CRCW0603820KFKEAC
R18 = RES0000B: RES SMD 1K OHM 0.1% 1/10W 0603; Manufacturer: Susumu; Manufacturer P/N: RG1608P-102-B-T5; Power: 0.100W; Device ID: RES0000B; VALUE: 1kΩ; Mounting Type: Surface Mount; Part Type: Resistor; Operating Temperature: -55°C ~ 155°C; Package: 0603 (1608 Metric); Tolerance: ±0.1%; Composition: Thin Film; Supplier1: Digi-Key; Supplier1 P/N: RG16P1.0KBCT-ND; Supplier2: Mouser; Supplier2 P/N: 754-RG1608P-102-B-T5
R19 = RES0002A: RES 47.5k OHM 1% 1/10W 0603; Manufacturer: Vishay Dale; Manufacturer P/N: ‎CRCW0603820KFKEAC‎; Power: 0.100W; Device ID: RES0002A; VALUE: 47.5kΩ; Mounting Type: Surface Mount; Part Type: Resistor; Operating Temperature: -55°C ~ 155°C; Package: 0603 (1608 Metric); Tolerance: ±1%; Composition: Thick Film; Supplier1: Digi-Key; Supplier1 P/N: ‎541-5568-1-ND‎; Supplier2: Mouser; Supplier2 P/N: 71-CRCW0603820KFKEAC
R20 = RES00029: RES 22.1k OHM 1% 1/10W 0603; Manufacturer: Vishay Dale; Manufacturer P/N: ‎CRCW0603820KFKEAC‎; Power: 0.100W; Device ID: RES00029; VALUE: 22.1kΩ; Mounting Type: Surface Mount; Part Type: Resistor; Operating Temperature: -55°C ~ 155°C; Package: 0603 (1608 Metric); Tolerance: ±1%; Composition: Thick Film; Supplier1: Digi-Key; Supplier1 P/N: ‎541-5568-1-ND‎; Supplier2: Mouser; Supplier2 P/N: 71-CRCW0603820KFKEAC
R28 R29 R31 R39 R95 R96 = RES00024: RES 4.7k OHM 1% 1/10W 0603; Manufacturer: Vishay Dale; Manufacturer P/N: ‎CRCW0603820KFKEAC‎; Power: 0.100W; Device ID: RES00024; VALUE: 4.7kΩ; Mounting Type: Surface Mount; Part Type: Resistor; Operating Temperature: -55°C ~ 155°C; Package: 0603 (1608 Metric); Tolerance: ±1%; Composition: Thick Film; Supplier1: Digi-Key; Supplier1 P/N: ‎541-5568-1-ND‎; Supplier2: Mouser; Supplier2 P/N: 71-CRCW0603820KFKEAC
R66 R68 R94 = RES00033: RES 0 OHM 1% 1/10W 0603; Manufacturer: Vishay Dale; Manufacturer P/N: ‎CRCW0603820KFKEAC‎; Power: 0.100W; Device ID: RES00033; VALUE: 0Ω; Mounting Type: Surface Mount; Part Type: Resistor; Operating Temperature: -55°C ~ 155°C; Package: 0603 (1608 Metric); Tolerance: ±1%; Composition: Thick Film; Supplier1: Digi-Key; Supplier1 P/N: ‎541-5568-1-ND‎; Supplier2: Mouser; Supplier2 P/N: 71-CRCW0603820KFKEAC
R92 R93 = RES0001B: RES SMD 10K OHM 5% 1/10W 0603; Manufacturer: Vishay Dale; Manufacturer P/N: CRCW060310K0JNEA; Power: 0.100W; Device ID: RES0001B; VALUE: 10kΩ; Mounting Type: Surface Mount; Part Type: Resistor; Operating Temperature: -55°C ~ 155°C; Package: 0603 (1608 Metric); Tolerance: ±5%; Composition: Thick Film; Supplier1: Digi-Key; Supplier1 P/N: 541-10KGCT-ND; Supplier2: Mouser; Supplier2 P/N: 71-CRCW0603J-10K-E3
R97 = RES00039: RES 30 OHM 1% 1/10W 0603; Manufacturer: Vishay Dale; Manufacturer P/N: ‎CRCW0603820KFKEAC‎; Power: 0.100W; Device ID: RES00039; VALUE: 30Ω; Mounting Type: Surface Mount; Part Type: Resistor; Operating Temperature: -55°C ~ 155°C; Package: 0603 (1608 Metric); Tolerance: ±1%; Composition: Thick Film; Supplier1: Digi-Key; Supplier1 P/N: ‎541-5568-1-ND‎; Supplier2: Mouser; Supplier2 P/N: 71-CRCW0603820KFKEAC
R98 = RES00037: RES 69.8 OHM 1% 1/10W 0603; Manufacturer: Vishay Dale; Manufacturer P/N: ‎CRCW0603820KFKEAC‎; Power: 0.100W; Device ID: RES00037; VALUE: 69.8Ω; Mounting Type: Surface Mount; Part Type: Resistor; Operating Temperature: -55°C ~ 155°C; Package: 0603 (1608 Metric); Tolerance: ±1%; Composition: Thick Film; Supplier1: Digi-Key; Supplier1 P/N: ‎541-5568-1-ND‎; Supplier2: Mouser; Supplier2 P/N: 71-CRCW0603820KFKEAC
R99 R100 = RES00034: RES 60 OHM 1% 1/10W 0603; Manufacturer: Vishay Dale; Manufacturer P/N: ‎CRCW0603820KFKEAC‎; Power: 0.100W; Device ID: RES00034; VALUE: 60Ω; Mounting Type: Surface Mount; Part Type: Resistor; Operating Temperature: -55°C ~ 155°C; Package: 0603 (1608 Metric); Tolerance: ±1%; Composition: Thick Film; Supplier1: Digi-Key; Supplier1 P/N: ‎541-5568-1-ND‎; Supplier2: Mouser; Supplier2 P/N: 71-CRCW0603820KFKEAC
R102 = RFP00002: 0603 RF Passive; VALUE: 0603; Device ID: RFP00002; Mounting Type: Surface Mount; Part Type: Passive
S4 = GPTS202312B: SWITCH TACTILE SPST-NO 0.05A 24V; Manufacturer: TE Connectivity ALCOSWITCH Switches; Manufacturer P/N: FSM4JSMASTR; Switch Function: Off-Mom; Contact Rating @ Voltage: 0.05A @ 24VDC; Operating Force: 160gf; Device ID: GPTS202312B; Part Type: Button; VALUE: SPST-NO; Operating Temperature: -40°C ~ 105°C; Package: 4-Lead SMT; Supplier1: Digi-Key; Supplier1 P/N: 450-2141-1-ND; Supplier2: Mouser; Supplier2 P/N: 506-1-1977223-0; Mounting Type: Surface Mount
Y1 = XTL00004: CRYSTAL 32.7680KHZ 9PF SMD; Manufacturer: EPSON; Manufacturer P/N: FC-135R 32.7680KF-AC3; Tolerance: ±10ppm; Operating Mode: Fundamental; ESR: 50kΩ; Device ID: XTL00004; Part Type: XTAL; VALUE: 32.7680kHz; Operating Temperature: -20°C ~ 70°C; Load Capacitance: 9pF; Package: 2-SMD, No Lead; Supplier1: Digi-Key; Supplier1 P/N: SER4075TR-ND; Supplier2: Mouser; Supplier2 P/N: 732-5R32.7680KF-AC3 / 729-G43270021; Mounting Type: Surface Mount
Y2 = XTL00003: CRYSTAL 32.7680KHZ 12.5PF SMD; Manufacturer: ECS; Manufacturer P/N: ECS-120-8-30B-CKM; Load Capacitance: 8pF; Tolerance: ±10ppm; Operating Mode: Fundamental; ESR: 80Ω; Device ID: XTL00003; Part Type: XTAL; VALUE: 12.0000MHz; Operating Temperature: -20°C ~ 70°C; Package: 4-SMD, No Lead; Supplier1: Digi-Key; Supplier1 P/N: XC1836TR-ND; Supplier2 P/N: 729-G43270021; Mounting Type: Surface Mount

## Sheet LEDS & BUTTONS.SchDoc
size 381 x 241 mm
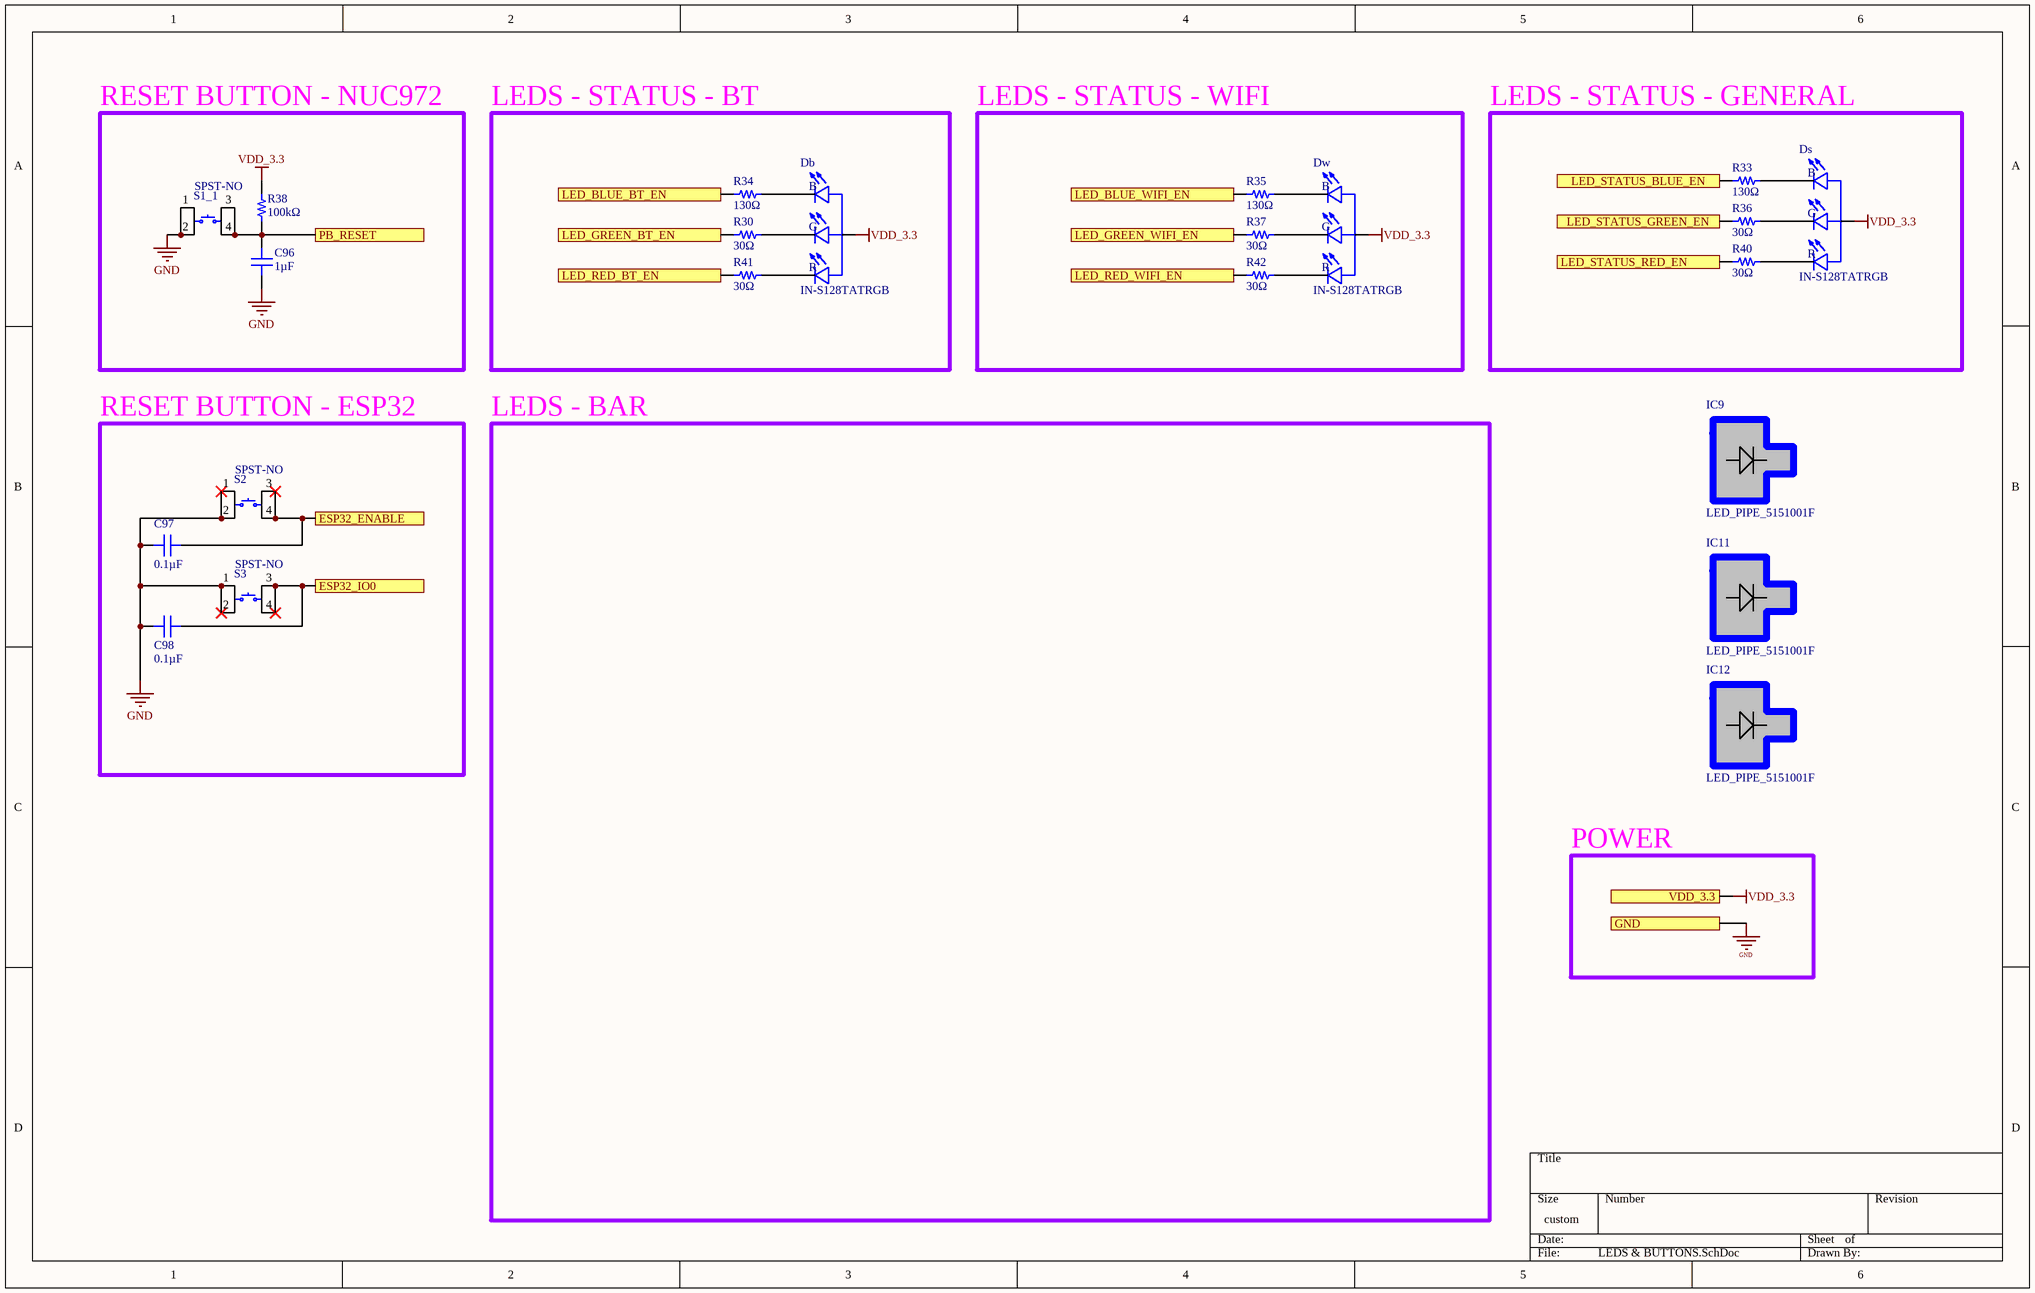
[diagram p9: LEDS & BUTTONS.SchDoc]

### Parts
C96  1µF  [CAP 0603_1608]
C97  0.1µF  [CAP 0603_1608 RF]
C98  0.1µF  [CAP 0603_1608 RF]
Db  IN-S128TATRGB  [LEDSC270X320X110-4N]
Ds  IN-S128TATRGB  [LEDSC270X320X110-4N]
Dw  IN-S128TATRGB  [LEDSC270X320X110-4N]
IC9  LED_PIPE_5151001F  [LED PIPE 5151001F]
IC11  LED_PIPE_5151001F  [LED PIPE 5151001F]
IC12  LED_PIPE_5151001F  [LED PIPE 5151001F]
R30  30Ω  [RES 0603_1608 RF]
R33  130Ω  [RES 0603_1608 RF]
R34  130Ω  [RES 0603_1608 RF]
R35  130Ω  [RES 0603_1608 RF]
R36  30Ω  [RES 0603_1608 RF]
R37  30Ω  [RES 0603_1608 RF]
R38  100kΩ  [RES 0402_1005 RF]
R40  30Ω  [RES 0603_1608 RF]
R41  30Ω  [RES 0603_1608 RF]
R42  30Ω  [RES 0603_1608 RF]
S1_1  SPST-NO  [TE FSM4JSMA]
S2  SPST-NO  [TE FSM4JSMA]
S3  SPST-NO  [TE FSM4JSMA]

### Blocks framed on the sheet
RESET BUTTON - NUC972: C96 R38 S1_1
LEDS - STATUS - BT: Db R30 R34 R41
LEDS - STATUS - WIFI: Dw R35 R37 R42
LEDS - STATUS - GENERAL: Ds R33 R36 R40
RESET BUTTON - ESP32: C97 C98 S2 S3

### Ports
ESP32_ENABLE, ESP32_IO0, GND, LED_BLUE_BT_EN, LED_BLUE_WIFI_EN, LED_GREEN_BT_EN, LED_GREEN_WIFI_EN, LED_RED_BT_EN, LED_RED_WIFI_EN, LED_STATUS_BLUE_EN, LED_STATUS_GREEN_EN, LED_STATUS_RED_EN, PB_RESET, VDD_3.3

### Nets
GND: C96.1 C97.2 C98.2 S1_1.1 S1_1.2 S2.1 S2.2 S3.1 S3.2 ; port GND
VDD_3.3: Db.1 Ds.1 Dw.1 R38.2 ; port VDD_3.3  [project net VDD_3.3_1]
NetA1_35: C96.2 R38.1 S1_1.3 S1_1.4 ; port PB_RESET
NetA1_137: R40.1 ; port LED_STATUS_RED_EN
NetA1_139: R33.1 ; port LED_STATUS_BLUE_EN
NetA1_141: R36.1 ; port LED_STATUS_GREEN_EN
NetC97_1: C97.1 S2.3 S2.4 ; port ESP32_ENABLE
NetC98_1: C98.1 S3.3 S3.4 ; port ESP32_IO0
NetDb_2: Db.2 R34.2
NetDb_3: Db.3 R41.2
NetDb_4: Db.4 R30.2
NetDs_2: Ds.2 R33.2
NetDs_3: Ds.3 R40.2
NetDs_4: Ds.4 R36.2
NetDw_2: Dw.2 R35.2
NetDw_3: Dw.3 R42.2
NetDw_4: Dw.4 R37.2
NetR30_1: R30.1 ; port LED_GREEN_BT_EN
NetR34_1: R34.1 ; port LED_BLUE_BT_EN
NetR35_1: R35.1 ; port LED_BLUE_WIFI_EN
NetR37_1: R37.1 ; port LED_GREEN_WIFI_EN
NetR41_1: R41.1 ; port LED_RED_BT_EN
NetR42_1: R42.1 ; port LED_RED_WIFI_EN

### Notes on the sheet
- LEDS - BAR
- POWER
- (in symbol IN-S128TATRGB) B; G; R

### Library data of the parts
C96 = CAP00007: CAP CER 1UF 10V X7R 0603; Manufacturer: KEMET; Manufacturer P/N: C0603C105K8RACTU; Tolerance: ±10%; Device ID: CAP00007; Mounting Type: Surface Mount; Part Type: Capacitor; VALUE: 1µF; Operating Temperature: -55°C ~ 125°C; Voltage: 10V; Package: 0603 (1608 Metric); Supplier1: Digi-Key; Supplier1 P/N: 399-11133-1-ND; Supplier2: Mouser; Supplier2 P/N: 80-C0603C105K8R; Temperature Coefficient: X7R
C97 C98 = CAP00039: as C31 on sheet SOC LPC1787; Device ID: CAP00039; Mounting Type: Surface Mount; Part Type: Capacitor; VALUE: 0.1µF; Operating Temperature: -55°C ~ 125°C; Voltage: 16V; Package: 0603 (1608 Metric); Supplier1: Digi-Key; Supplier1 P/N: 399-C0603C104M4RACAUTOCT-ND; Supplier2: Mouser; Supplier2 P/N: C0603C104M4RACAUTO; Temperature Coefficient: X7R
Db Ds Dw = IN-S128TATRGB: Red, Green, Blue _RGB_ 625nm Red, 520nm Green, 465nm Blue LED Indication - Discrete 2.2V Red, 3.2V Green, 3.2V Blue 1210 _3225 Metric_; MF: Inolux; MP: IN-S128TATRGB; SnapEDA_Link: https://www.snapeda.com/parts/IN-S128TATRGB/Inolux/view-part/3219922/?ref=snap; Price: None; Package: 1210 Inolux; Availability: Unavailable; Value: *
IC9 IC11 IC12 = LED0000E: -; VALUE: PIPE; Device ID: LED0000E; Mounting Type: Surface Mount; Part Type: LED; Manufacturer: -; Manufacturer P/N: -; Operating Temperature: -; Package: -; Color: -; If - Forward Current: -; Vf - Forward Voltage: -; Wavelength: -; Viewing Angle: -; Lens Color: -; Supplier1: -; Supplier1 P/N: -
R30 R36 R37 R40-R42 = RES00039: as R97 on sheet SOC LPC1787; Device ID: RES00039; VALUE: 30Ω; Mounting Type: Surface Mount; Part Type: Resistor; Operating Temperature: -55°C ~ 155°C; Package: 0603 (1608 Metric); Tolerance: ±1%; Composition: Thick Film; Supplier1: Digi-Key; Supplier1 P/N: ‎541-5568-1-ND‎; Supplier2: Mouser; Supplier2 P/N: 71-CRCW0603820KFKEAC
R33-R35 = RES00038: RES 130 OHM 1% 1/10W 0603; Manufacturer: Vishay Dale; Manufacturer P/N: ‎CRCW0603820KFKEAC‎; Power: 0.100W; Device ID: RES00038; VALUE: 130Ω; Mounting Type: Surface Mount; Part Type: Resistor; Operating Temperature: -55°C ~ 155°C; Package: 0603 (1608 Metric); Tolerance: ±1%; Composition: Thick Film; Supplier1: Digi-Key; Supplier1 P/N: ‎541-5568-1-ND‎; Supplier2: Mouser; Supplier2 P/N: 71-CRCW0603820KFKEAC
R38 = RES0001D: RES SMD 100K OHM 1% 1/16W 0402; Manufacturer: Vishay Dale; Manufacturer P/N: RCG0402100KFKED; Power: 0.063W; Device ID: RES0001D; VALUE: 100kΩ; Mounting Type: Surface Mount; Part Type: Resistor; Operating Temperature: -55°C ~ 155°C; Package: 0402 (1005 Metric); Tolerance: ±1%; Composition: Thick Film; Supplier1: Digi-Key; Supplier1 P/N: 541-1751-1-ND; Supplier2: Mouser; Supplier2 P/N: 71-RCG0402100KFKED
S1_1 S2 S3 = GPTS202312B: as S4 on sheet SOC LPC1787; Device ID: GPTS202312B; Part Type: Button; VALUE: SPST-NO; Operating Temperature: -40°C ~ 105°C; Package: 4-Lead SMT; Supplier1: Digi-Key; Supplier1 P/N: 450-2141-1-ND; Supplier2: Mouser; Supplier2 P/N: 506-1-1977223-0; Mounting Type: Surface Mount

## Sheet RTC.SchDoc
size A
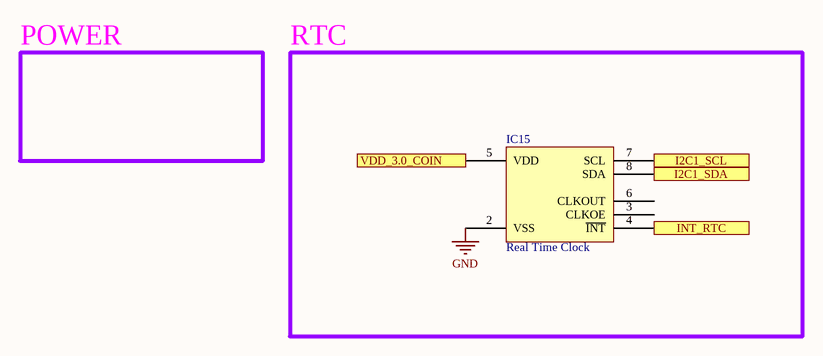
[diagram p10: RTC.SchDoc]

### Parts
IC15  Real Time Clock  [MICRO CRYSTAL 8-SON]

### Blocks framed on the sheet
RTC: IC15

### Ports
I2C1_SCL, I2C1_SDA, INT_RTC, VDD_3.0_COIN

### Nets
GND: IC15.2(VSS)
NetA1_38: IC15.5(VDD) ; port VDD_3.0_COIN
NetA1_54: IC15.4(~{INT}) ; port INT_RTC
NetA1_94: IC15.8(SDA) ; port I2C1_SDA
NetA1_96: IC15.7(SCL) ; port I2C1_SCL

Not connected (* = marked no-connect by the designer): IC15 3(CLKOE) 6(CLKOUT)

### Notes on the sheet
- POWER

### Library data of the parts
IC15 = RTC00001: IC RTC CLK/CALENDAR I2C 8-SMT; Manufacturer: Micro Crystal AG; Manufacturer P/N: RV-8263-C7-32.768KHZ-20PPM-TA-QC; Time Format: HH:MM:SS; Date Format: YY-MM-DD-dd; Interface: I²C; Voltage - Supply: 0.9V ~ 5.5V; Current - Timekeeping Max: 240nA @ 3V; Device ID: RTC00001; Part Type: IC; VALUE: Real Time Clock; Package: 8-SON (3.2x1.5); Operating Temperature: -40°C ~ 85°C; Features: Alarm, Leap Year, RAM; Memory Size: -; Voltage - Supply Battery: -; Supplier1: Digi-Key; Supplier1 P/N: 2195-RV-8263-C7-32.768KHZ-20PPM-TA-QCCT-ND; Supplier2: Mouser; Supplier2 P/N: 428-8263C7328K20PTQC